# Altium schematic sheet 0.2-3.3VR.SchDoc
size A4; SheetNumber: 3; SheetTotal: 10
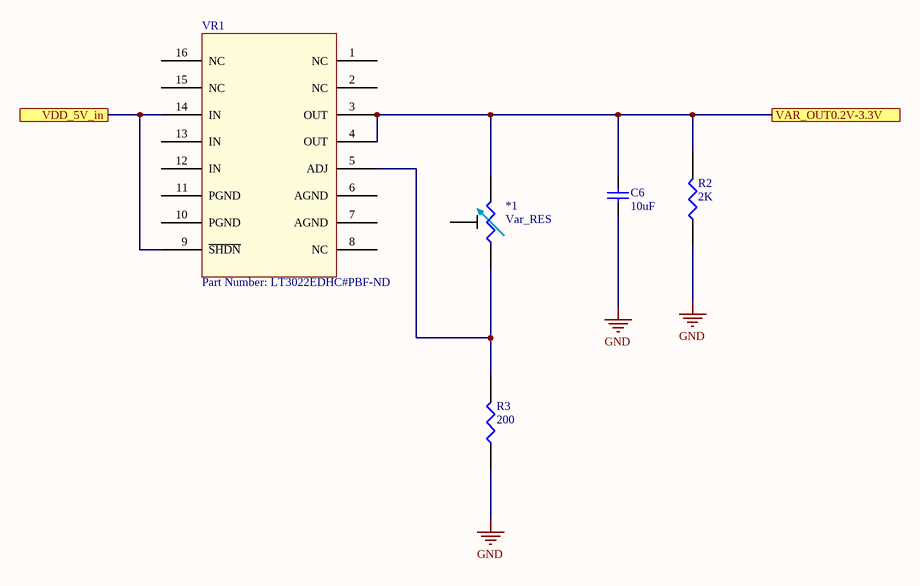
[diagram p0: 0.2-3.3VR.SchDoc]

## Parts
*1  Var_RES  [res_var_5turn]
C6  10uF  [C0805]
R2  2K
R3  200
VR1  Part Number: LT3022EDHC#PBF-ND  [LT3022]

## Ports
VAR_OUT0.2V-3.3V, VDD_5V_in

## Nets
GND: C6.1 R2.1 R3.1
VAR_OUT0.2V-3.3V: *1.3 C6.2 R2.2 VR1.3(OUT) VR1.4(OUT) ; port VAR_OUT0.2V-3.3V
VDD_5V_in: VR1.9(~{SHDN}) VR1.14(IN) ; port VDD_5V_in
Net*1_1: *1.1 R3.2 VR1.5(ADJ)

Not connected (* = marked no-connect by the designer): *1 2; VR1 1(NC) 2(NC) 6(AGND) 7(AGND) 8(NC) 10(PGND) 11(PGND) 12(IN) 13(IN) 15(NC) 16(NC)

## Library data of the parts
C6 = Cap 10uF: Manufacturer: Taiyo Yuden; Manufacturer Part Number: UMK212SD103KD-T; Dielectric Material: Ceramic; Capacitance: 10nF; Tolerance: 10%; Voltage Rating: 50V; Supplier 1: Digi-Key; Stock 1: 14125; Pricing 1: 1=0.47, 10=0.323, 100=0.1941, 500=0.1455, 1000=0.1229 (USD); Mount: Surface Mount; Case/Package: 0805; Number of Pins: 2; Case Code (Metric): 2012; Case Code (Imperial): 0805; Min Operating Temperature: -55°C; Max Operating Temperature: 125°C; Packaging: Tape and Reel; Package Quantity: 1; Voltage Rating (DC): 50V; Termination: SMD/SMT; Length: 2mm; Height: 0.85mm; Width: 0.049inch; Thickness: 0.037inch; Depth: 1.25mm; Radiation Hardening: No; Lead Free: Lead Free; Halogen Free: Halogen Free; ComponentLink1URL: https://datasheet.ciiva.com/138/umk212sd103kd-t-ss-138661.pdf; ComponentLink1Description: https://datasheet.ciiva.com/138/umk212sd103kd-t-ss-138661.pdf; ComponentLink2URL: https://datasheet.ciiva.com/138/mlcc07-e-138662.pdf; ComponentLink2Description: https://datasheet.ciiva.com/138/mlcc07-e-138662.pdf; ComponentLink3URL: https://datasheet.ciiva.com/138/mlcc07-e-138663.pdf; ComponentLink3Description: https://datasheet.ciiva.com/138/mlcc07-e-138663.pdf; ComponentLink4URL: https://datasheet.ciiva.com/30140/303umk212sd103kd-t-30140925.pdf; ComponentLink4Description: https://datasheet.ciiva.com/30140/303umk212sd103kd-t-30140925.pdf; Supplier Part Number 1: 587-1114-1-ND
R2 = Res 2k: RES SMD 2K OHM 5% 1/4W 0805; Manufacturer: Stackpole Electronics; Manufacturer Part Number: RPC0805JT2K00; Resistance: 2kR; Max Power Dissipation: 250mW; Temperature Coefficient: 100ppm/°C; Supplier 1: Digi-Key; Supplier Part Number 1: RPC0805JT2K00CT-ND; RoHS: Yes; Category: Chip SMD Resistors; Stock 1: 2736; Pricing 1: 1=0.19000, 10=0.16400, 100=0.06430, 1000=0.02691, 2500=0.02467 (USD); Mount: Surface Mount; Case/Package: 0805; Case Code (Metric): 2012; Case Code (Imperial): 0805; Min Operating Temperature: -55°C; Max Operating Temperature: 155°C; Package Quantity: 5000; Packaging: Cut Tape; Tolerance: 5%; Resistor Type: Thick Film; Number of Terminations: 2; Features: Automotive AEC-Q200; Series: RPC; Length: 0.079inch; Width: 0.049inch; Height: 0.028inch; RoHS Compliant: Yes; ComponentLink1URL: http://www.seielect.com/Catalog/SEI-RPC.pdf?src-supplier=Digi-Key; ComponentLink1Description: http://www.seielect.com/Catalog/SEI-RPC.pdf?src-supplier=Digi-Key; ComponentLink2URL: https://www.seielect.com/Catalog/SEI-rpc.pdf?src-supplier=Digi-Key; ComponentLink2Description: https://www.seielect.com/Catalog/SEI-rpc.pdf?src-supplier=Digi-Key
R3 = Res 200: Res Thick Film 0805 200 Ohm 1% 1/8W 100ppm/C Molded SMD SMD Paper Tape on Plastic Reel; Manufacturer: Bourns; Manufacturer Part Number: CR0805-FX-2000ELF; Resistance: 200R; Power Rating: 125mW; Voltage Rating: 150V; Temperature Coefficient: 100ppm/°C; Supplier 1: Digi-Key; Supplier Part Number 1: 118-CR0805-FX-2000ELFCT-ND; RoHS: Yes; Category: Chip SMD Resistors; Stock 1: 1290; Pricing 1: 1=0.10000, 10=0.02700, 100=0.01110, 1000=0.00497, 2500=0.00431 (USD); Mount: Surface Mount; Case/Package: 0805; Case Code (Imperial): 0805; Case Code (Metric): 2012; Contact Plating: Tin; Min Operating Temperature: -55°C; Max Operating Temperature: 155°C; Packaging: Tape and Reel; Tolerance: 1%; Package Quantity: 5000; Resistor Type: Thick Film; Termination: SMD/SMT; Features: Moisture Resistant; Series: CR0805; Max Power Dissipation: 125mW; Number of Terminations: 2; Construction: Rectangular; Length: 2mm; Width: 1.25mm; Height: 0.5mm; Depth: 1.25mm; Thickness: 508um; Radiation Hardening: No; Military Standard: Not; RoHS Compliant: Yes; ComponentLink1URL: https://datasheet.ciiva.com/16935/chpreztr-16935215.pdf?src-supplier=Avnet+Europe; ComponentLink1Description: https://datasheet.ciiva.com/16935/chpreztr-16935215.pdf?src-supplier=Avnet+Europe
VR1 = LT3022: Linear Voltage Regulator IC Positive Adjustable 1 Output 1A 16-DFN (5x3)